# Altium schematic sheet PCB2 - grideye breakour.SchDoc
size A4; SheetNumber: 2; SheetTotal: 2
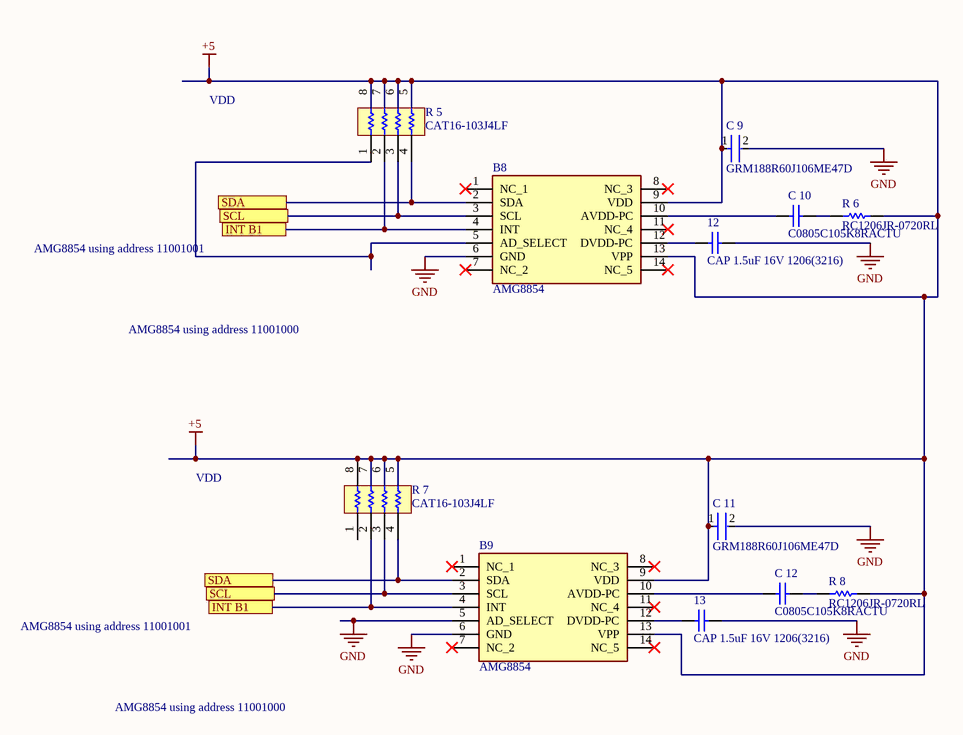
[diagram p0: PCB2 - grideye breakour.SchDoc]

## Parts
12  CAP 1.5uF 16V 1206(3216)  [CAPC1206(3216)190_M]
13  CAP 1.5uF 16V 1206(3216)  [CAPC1206(3216)190_M]
B8  AMG8854  [AMG8854]
B9  AMG8854  [AMG8854]
C_9  GRM188R60J106ME47D  [FP-GRM188-0_1-e0_2_0_55-IPC_A]
C_10  C0805C105K8RACTU  [CAPC2013X100X50ML20T25]
C_11  GRM188R60J106ME47D  [FP-GRM188-0_1-e0_2_0_55-IPC_A]
C_12  C0805C105K8RACTU  [CAPC2013X100X50ML20T25]
R_5  CAT16-103J4LF  [BOUR-CAT16-103J4LF_L]
R_6  RC1206JR-0720RL  [RESC3116X65X40NL10T20]
R_7  CAT16-103J4LF  [BOUR-CAT16-103J4LF_L]
R_8  RC1206JR-0720RL  [RESC3116X65X40NL10T20]

## Ports
INT B1, SCL, SDA

## Nets
+5: B8.9(VDD) B8.13(VPP) B9.9(VDD) B9.13(VPP) C_9.1 C_11.1 R_5.5 R_5.6 R_5.7 R_5.8 R_6.2 R_7.5 R_7.6 R_7.7 R_7.8 R_8.2
GND: 12.2 13.2 B8.6(GND) B9.5(AD_SELECT) B9.6(GND) C_9.2 C_11.2
INT B1: B8.4(INT) B9.4(INT) R_5.2 R_7.2 ; port INT B1
SCL: B8.3(SCL) B9.3(SCL) R_5.3 R_7.3 ; port SCL
SDA: B8.2(SDA) B9.2(SDA) R_5.4 R_7.4 ; port SDA
Net12_1: 12.1 B8.12(DVDD-PC)
Net13_1: 13.1 B9.12(DVDD-PC)
NetB8_5: B8.5(AD_SELECT) R_5.1
NetB8_10: B8.10(AVDD-PC) C_10.1
NetB9_10: B9.10(AVDD-PC) C_12.1
NetC_10_2: C_10.2 R_6.1
NetC_12_2: C_12.2 R_8.1

Not connected (* = marked no-connect by the designer): B8 1(NC_1)* 7(NC_2)* 8(NC_3)* 11(NC_4)* 14(NC_5)*; B9 1(NC_1)* 7(NC_2)* 8(NC_3)* 11(NC_4)* 14(NC_5)*; R_7 1

## Notes on the sheet
- VDD
- AMG8854 using address 11001001
- AMG8854 using address 11001000

## Library data of the parts
12 13 = CMP-1037-04758-1: CAP 1.5uF 16V ±10% 1206 (3216 Metric) Thickness 1.9mm SMD; Case-EIA: 1206; Case-Metric: 3216; Tolerance: Â±10%; Rated Voltage: 16 V; Value: 1.5uF; Technology: SMT; Max Thickness: 1.9 mm
B8 B9 = AMG8854: Product: Infrared Array Sensor Grid-EYE, Series/Type: AMG88xx (High performance type), Number of pixel: 64 (Vertical 8 x Horizontal 8 Matrix), Operating voltage (DC) (V): 5, Viewing angle (): 60, Amplification factor: Low gain, Mounting form: Surface Mount Type; Manufacturer_Name: Panasonic; Geometry.Height: 4.3mm; Mouser Part Number: 667-AMG8854; Mouser Price/Stock: https://www.mouser.co.uk/ProductDetail/Panasonic/AMG8854?qs=sSYV1F9c5cGiWvzHDbpBOw%3D%3D; Manufacturer_Part_Number: AMG8854; Datasheet Link: https://industrial.panasonic.com/cdbs/www-data/pdf/ADI8000/ADI8000C66.pdf
C_9 C_11 = CMP-2006-02792-2: Chip Multilayer Ceramic Capacitors for General Purpose, 0603, 10uF, X5R, 15%, 20%, 6.3V; Packaging: Tape and Reel; Voltage Rating (DC): 6.3V; Width: 0.031inch; Termination: SMD/SMT; Dielectric: X5R; Package Quantity: 4000; Voltage Rating: 6.3V; Capacitance: 10uF; Case/Package: 0603; Min Operating Temperature: -55°C; Voltage: 6.3V; Length: 1.6mm; Thickness: 0.035inch; Lead Free: Lead Free; Depth: 0.8mm; Case Code (Imperial): 0603; Max Operating Temperature: 85°C; Material: Ceramic; Height: 0.8mm; Tolerance: 20%; Mount: Surface Mount; REACH SVHC: No SVHC; Radiation Hardening: No; Case Code (Metric): 1608
C_10 C_12 = CMP-2007-03676-1: Manufacturer: Kemet; Part Number: C0805C105K8RACTU
R_5 R_7 = CMP-2000-06067-1: CAT / CAY 16 Series - Chip Resistor Array, 10 KOhm, +/- 5%, 50 V, -55 to 125 degC, 8-Pin SMD, RoHS, Tape and Reel; Manufacturer: Bourns; Power Per Element: 62.5mW; Online Catalog: CAT16Series; Resistance (Ohms): 10k; Number of Resistors: 4; EDA / CAD Models: DownloadfromAcceleratedDesigns; Temperature Coefficient: ±200ppm/°C; Circuit Type: Isolated; Other Names: CAT16-103J4LFDKR; Package Reference: CAT16-103J4LF; Datasheet Version: 09/2014; Series: CAT16; Manufacturer URL: http://www.bourns.com/; Mounting Type: SurfaceMount; Datasheet URL: http://www.mouser.com/ds/2/54/ATCAY-777361.pdf; Category: Resistors; Height: 0.024"(0.60mm); Mounting Technology: SurfaceMount; Applications: -; Size / Dimension: 0.126"Lx0.061"W(3.20mmx1.55mm); Packaging: Digi-Reel®; Package / Case: 1206(3216Metric),Concave,LongSideTerminals; Supplier Device Package: 1206; RoHS Information: CAT16MaterialDeclaration; Number of Pins: 8; Family: ResistorNetworks,Arrays; Standard Package: 1; Package Description: 8-Pin Surface Mount Device, Body 3.2 x 1.55 mm, Pitch 0.8 mm; Operating Temperature: -55°C~125°C; Tolerance: ±5%
R_6 R_8 = CMP-2003-03957-1: Manufacturer: Yageo; Part Number: RC1206JR-0720RL